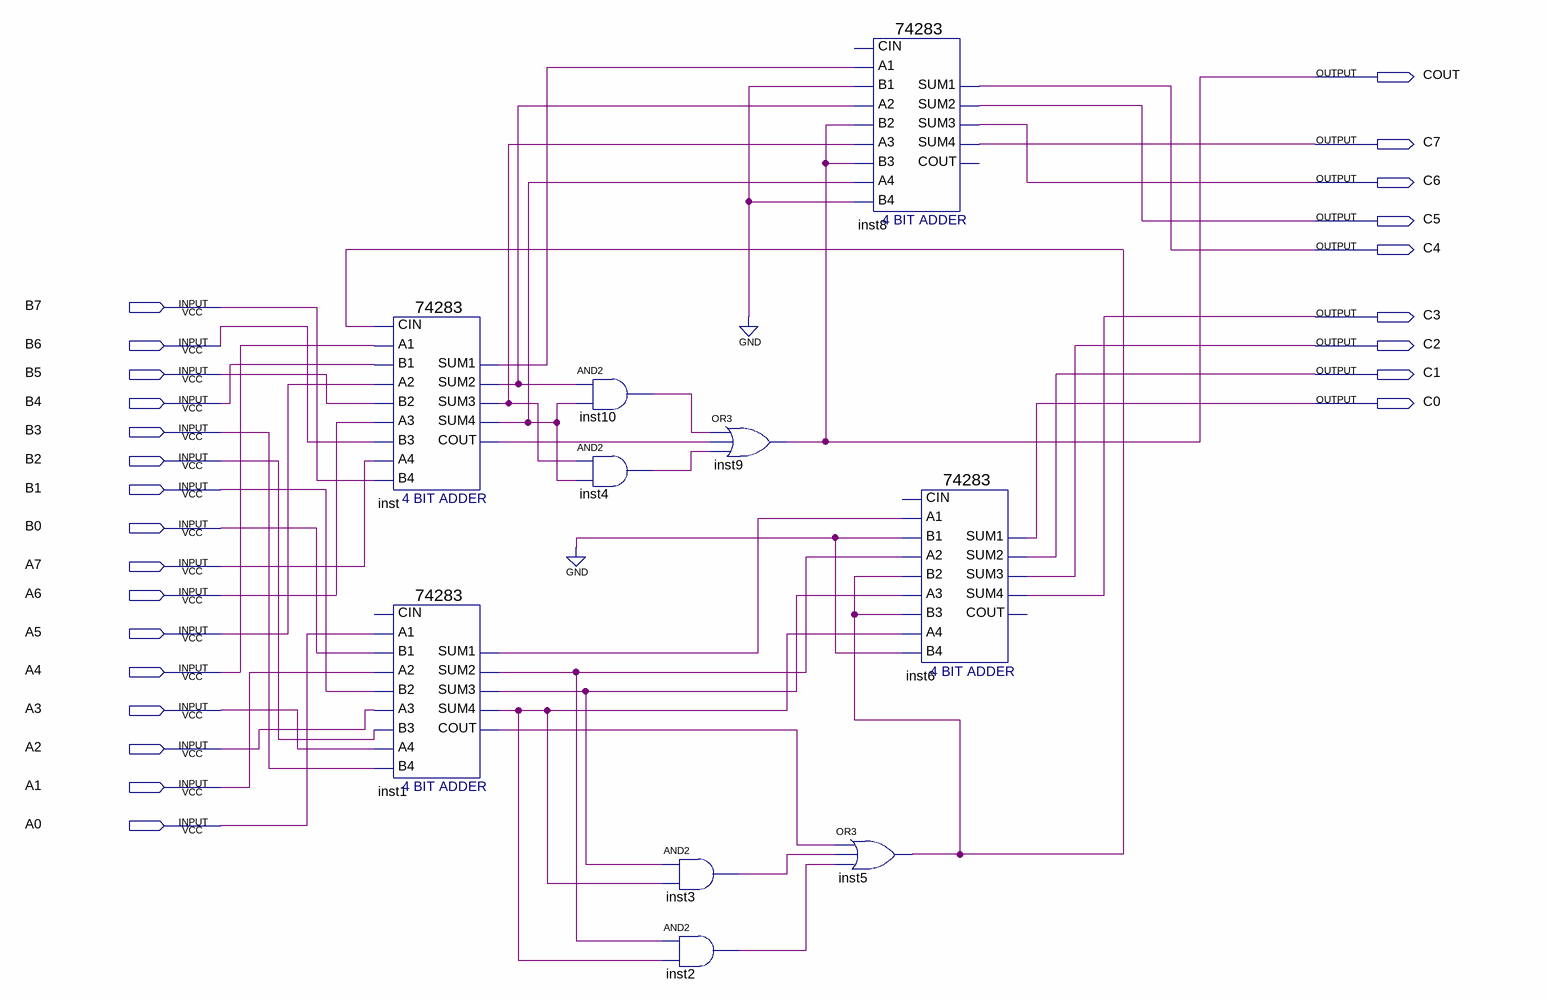
[diagram p0: schematic sheet]
// Quartus schematic Count.bdf as structural Verilog: 10 symbols, 25 pins
module Count (
  input  B7,
  input  B6,
  input  B5,
  input  B4,
  input  B3,
  input  B2,
  input  B1,
  input  B0,
  input  A7,
  input  A6,
  input  A5,
  input  A4,
  input  A3,
  input  A2,
  input  A1,
  input  A0,
  output COUT,
  output C7,
  output C6,
  output C5,
  output C4,
  output C3,
  output C2,
  output C1,
  output C0
);

  wire inst1_cout, inst1_sum1, inst1_sum2, inst1_sum3, inst1_sum4, inst2_out, inst3_out, inst4_out,
       inst5_out, inst10_out, inst_cout, inst_sum1, inst_sum2, inst_sum3, inst_sum4;

  \74283  inst (
    .CIN(inst5_out), .A1(A4), .A2(A5), .B2(B5), .A3(A6), .A4(A7), .B4(B7), .B1(B4), .B3(B6),
    .SUM4(inst_sum4), .COUT(inst_cout), .SUM1(inst_sum1), .SUM2(inst_sum2), .SUM3(inst_sum3));
  \74283  inst1 (
    .A1(A0), .A2(A1), .B2(B1), .A3(A2), .A4(A3), .B4(B3), .B1(B0), .B3(B2), .SUM4(inst1_sum4),
    .COUT(inst1_cout), .SUM1(inst1_sum1), .SUM2(inst1_sum2), .SUM3(inst1_sum3));  // open: CIN
  and inst10 (inst10_out, inst_sum2, inst_sum4);
  and inst4 (inst4_out, inst_sum3, inst_sum4);
  or inst9 (COUT, inst10_out, inst_cout, inst4_out);
  and inst3 (inst3_out, inst1_sum3, inst1_sum4);
  and inst2 (inst2_out, inst1_sum2, inst1_sum4);
  \74283  inst8 (
    .A1(inst_sum1), .A2(inst_sum2), .B2(COUT), .A3(inst_sum3), .A4(inst_sum4), .B4(1'b0), .B1(1'b0),
    .B3(COUT), .SUM4(C7), .SUM1(C4), .SUM2(C5), .SUM3(C6));  // open: CIN, COUT
  or inst5 (inst5_out, inst1_cout, inst3_out, inst2_out);
  \74283  inst6 (
    .A1(inst1_sum1), .A2(inst1_sum2), .B2(inst5_out), .A3(inst1_sum3), .A4(inst1_sum4), .B4(1'b0), .B1(1'b0),
    .B3(inst5_out), .SUM4(C3), .SUM1(C0), .SUM2(C1), .SUM3(C2));  // open: CIN, COUT
endmodule
